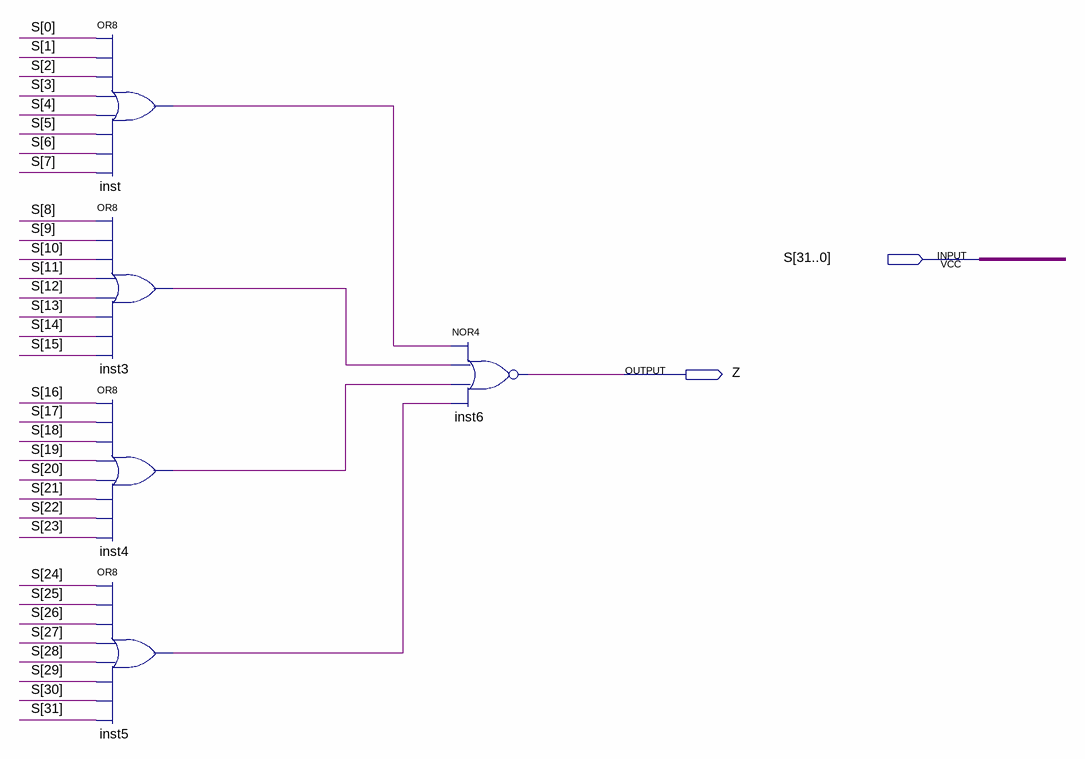
[diagram p0: schematic sheet]
// Quartus schematic Zero.bdf as structural Verilog: 5 symbols, 2 pins
module Zero (
  input  [31:0] S,
  output Z
);

  wire inst3_out, inst4_out, inst5_out, inst_out;

  or inst (inst_out, S[0], S[1], S[2], S[3], S[4], S[5], S[6], S[7]);
  or inst3 (inst3_out, S[8], S[9], S[10], S[11], S[12], S[13], S[14], S[15]);
  or inst4 (inst4_out, S[16], S[17], S[18], S[19], S[20], S[21], S[22], S[23]);
  or inst5 (inst5_out, S[24], S[25], S[26], S[27], S[28], S[29], S[30], S[31]);
  nor inst6 (Z, inst_out, inst3_out, inst4_out, inst5_out);
endmodule
